# EAGLE schematic Mixer (EAGLE 9.6.2)

## Sheet 1 of 5: Mixer
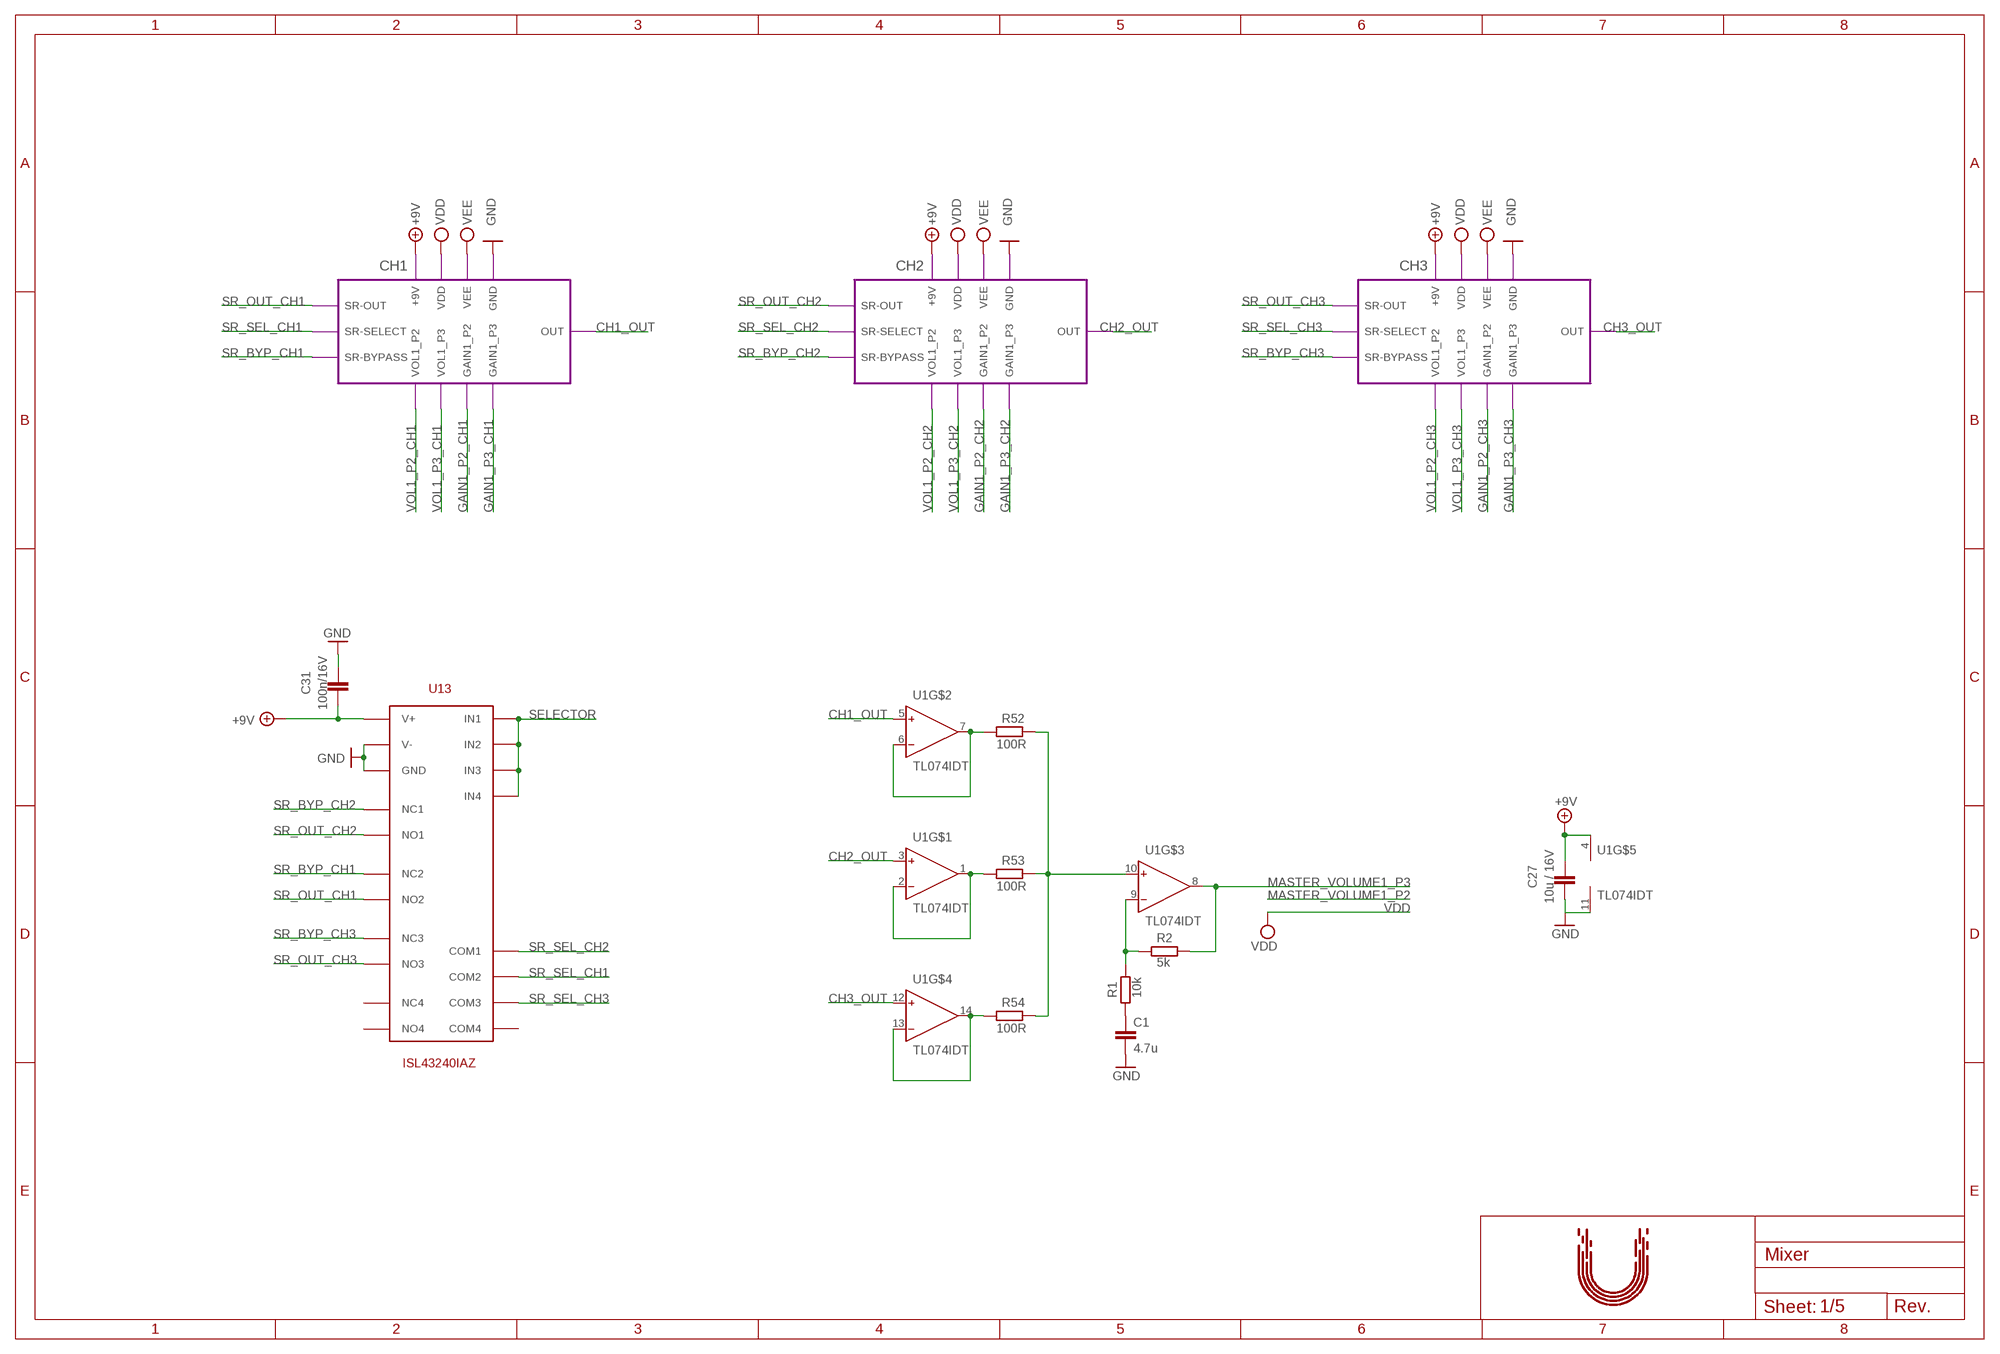
[diagram p0: schematic, sheet 1]

### Parts
C1  4.7u  CAPACITORC-0603  [0603]
C27  10u / 16V  CAPACITORC-0603  [0603]
C31  100n/16V  CAPACITORC-0603  [0603]
R1  10k  RESISTOR  [R0603]
R2  5k  RESISTOR  [R0603]
R52  100R  RESISTOR  [R0603]
R53  100R  RESISTOR  [R0603]
R54  100R  RESISTOR  [R0603]
U1  TL074IDT  [SOIC127P600X175-14N]
U13  ISL43240IAZ  ANALOG_SELECTORSSOP-20  [SOP65P777X173-20N]
U$1  UTBULT_DESIGN4  [UD_4]

### Module instances
CH1 = CHANNEL_INPUT
CH2 = CHANNEL_INPUT
CH3 = CHANNEL_INPUT

### Nets
+9V: C27.2 C31.1 U1.4(V+) U13.16(V+) ; port CH1.+9V CH2.+9V CH3.+9V ; also sheet 2,3,4,5
CH1_OUT: U1.5(IN+) ; port CH1.OUT ; also sheet 4
CH2_OUT: U1.3(IN+) ; port CH2.OUT ; also sheet 4
CH3_OUT: U1.12(IN+) ; port CH3.OUT ; also sheet 4
GAIN1_P2_CH1: port CH1.GAIN1_P2 ; also sheet 5
GAIN1_P2_CH2: port CH2.GAIN1_P2 ; also sheet 5
GAIN1_P2_CH3: port CH3.GAIN1_P2 ; also sheet 5
GAIN1_P3_CH1: port CH1.GAIN1_P3 ; also sheet 5
GAIN1_P3_CH2: port CH2.GAIN1_P3 ; also sheet 5
GAIN1_P3_CH3: port CH3.GAIN1_P3 ; also sheet 5
GND: C1.2 C27.1 C31.2 U1.11(V-) U13.5(V-) U13.6(GND) ; port CH1.GND CH2.GND CH3.GND ; also sheet 2,3,4,5
MASTER_VOLUME1_P3: R2.2 U1.8(OUT) ; also sheet 5
N$1: R52.2 R53.2 R54.2 U1.10(IN+)
N$2: R1.2 R2.1 U1.9(IN-)
N$4: C1.1 R1.1
N$33: R52.1 U1.6(IN-) U1.7(OUT)
N$36: R53.1 U1.1(OUT) U1.2(IN-)
N$39: R54.1 U1.13(IN-) U1.14(OUT)
SELECTOR: U13.1(IN1) U13.10(IN2) U13.11(IN3) U13.20(IN4) ; also sheet 2,5
SR_BYP_CH1: U13.7(NC2) ; port CH1.SR-BYPASS
SR_BYP_CH2: U13.4(NC1) ; port CH2.SR-BYPASS
SR_BYP_CH3: U13.14(NC3) ; port CH3.SR-BYPASS
SR_OUT_CH1: U13.9(NO2) ; port CH1.SR-OUT
SR_OUT_CH2: U13.2(NO1) ; port CH2.SR-OUT
SR_OUT_CH3: U13.12(NO3) ; port CH3.SR-OUT
SR_SEL_CH1: U13.8(COM2) ; port CH1.SR-SELECT
SR_SEL_CH2: U13.3(COM1) ; port CH2.SR-SELECT
SR_SEL_CH3: U13.13(COM3) ; port CH3.SR-SELECT
VDD: port CH1.VDD CH2.VDD CH3.VDD ; also sheet 2,3,4,5
VEE: port CH1.VEE CH2.VEE CH3.VEE ; also sheet 2,3,4
VOL1_P2_CH1: port CH1.VOL1_P2 ; also sheet 5
VOL1_P2_CH2: port CH2.VOL1_P2 ; also sheet 5
VOL1_P2_CH3: port CH3.VOL1_P2 ; also sheet 5
VOL1_P3_CH1: port CH1.VOL1_P3 ; also sheet 5
VOL1_P3_CH2: port CH2.VOL1_P3 ; also sheet 5
VOL1_P3_CH3: port CH3.VOL1_P3 ; also sheet 5
Unconnected: U13.17(NC4) U13.18(COM4) U13.19(NO4)

## Sheet 2 of 5: Mixed send/return
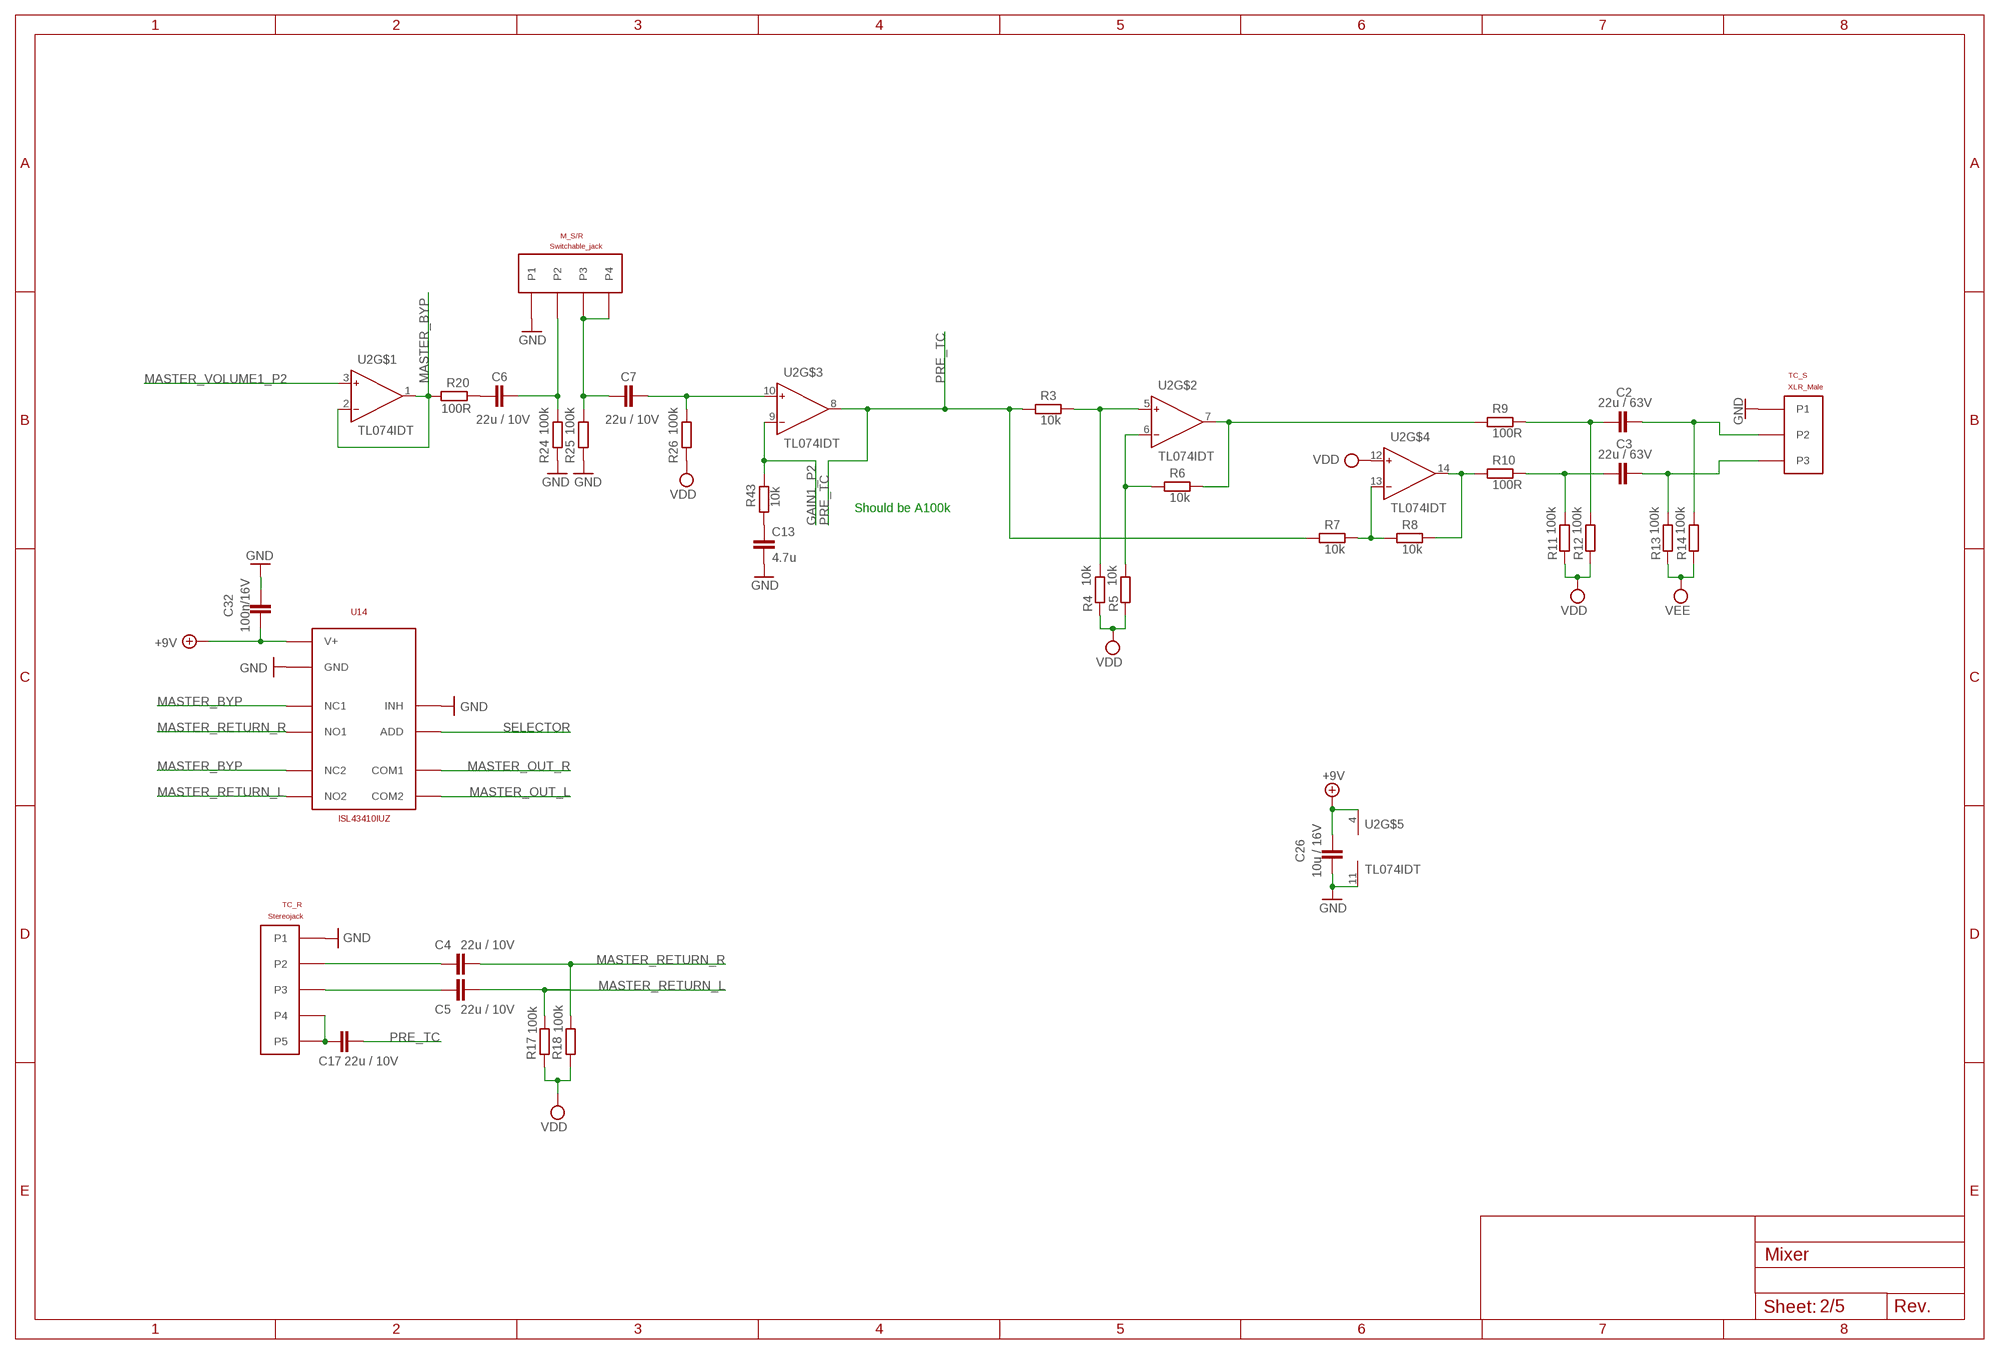
[diagram p1: schematic, sheet 2]

### Parts
C2  22u / 63V  CAPACITOR2220  [2220]
C3  22u / 63V  CAPACITOR2220  [2220]
C4  22u / 10V  CAPACITORC-0603  [0603]
C5  22u / 10V  CAPACITORC-0603  [0603]
C6  22u / 10V  CAPACITORC-0603  [0603]
C7  22u / 10V  CAPACITORC-0603  [0603]
C13  4.7u  CAPACITORC-0603  [0603]
C17  22u / 10V  CAPACITORC-0603  [0603]
C26  10u / 16V  CAPACITORC-0603  [0603]
C32  100n/16V  CAPACITORC-0603  [0603]
M_S/R  Switchable_jack  4_PIN_PORT  [4_PIN_PORT]
R3  10k  RESISTOR  [R0603]
R4  10k  RESISTOR  [R0603]
R5  10k  RESISTOR  [R0603]
R6  10k  RESISTOR  [R0603]
R7  10k  RESISTOR  [R0603]
R8  10k  RESISTOR  [R0603]
R9  100R  RESISTOR  [R0603]
R10  100R  RESISTOR  [R0603]
R11  100k  RESISTOR  [R0603]
R12  100k  RESISTOR  [R0603]
R13  100k  RESISTOR  [R0603]
R14  100k  RESISTOR  [R0603]
R17  100k  RESISTOR  [R0603]
R18  100k  RESISTOR  [R0603]
R20  100R  RESISTOR  [R0603]
R24  100k  RESISTOR  [R0603]
R25  100k  RESISTOR  [R0603]
R26  100k  RESISTOR  [R0603]
R43  10k  RESISTOR  [R0603]
TC_R  Stereojack  5_PIN_PORT  [5_PIN_PORT]
TC_S  XLR_Male  3_PIN_PORT  [3_PIN_PORT]
U2  TL074IDT  [SOIC127P600X175-14N]
U14  ISL43410IUZ  2CH_ANALOG_SELECTORMSOP-10  [SOP50P490X110-10N]

### Nets
+9V: C26.2 C32.1 U2.4(V+) U14.10(V+) ; also sheet 1,3,4,5
GAIN1_P2: R43.2 U2.9(IN-) ; also sheet 5
GND: C13.2 C26.1 C32.2 M_S/R.P$1(P1) R24.1 R25.1 TC_R.P$1(P1) TC_S.P$1(P1) U2.11(V-) U14.4(INH) U14.5(GND) ; also sheet 1,3,4,5
MASTER_BYP: R20.1 U2.1(OUT) U2.2(IN-) U14.3(NC1) U14.7(NC2)
MASTER_OUT_L: U14.8(COM2) ; also sheet 3,4
MASTER_OUT_R: U14.2(COM1) ; also sheet 3,4
MASTER_RETURN_L: C5.2 R17.2 U14.9(NO2)
MASTER_RETURN_R: C4.2 R18.2 U14.1(NO1)
MASTER_VOLUME1_P2: U2.3(IN+) ; also sheet 1,5
N$5: R3.2 R4.2 U2.5(IN+)
N$6: R5.2 R6.1 U2.6(IN-)
N$7: R6.2 R9.1 U2.7(OUT)
N$8: R7.2 R8.1 U2.13(IN-)
N$9: R8.2 R10.1 U2.14(OUT)
N$10: C3.1 R10.2 R11.2
N$11: C2.1 R9.2 R12.2
N$13: C4.1 TC_R.P$2(P2)
N$14: C5.1 TC_R.P$3(P3)
N$20: C7.1 M_S/R.P$3(P3) M_S/R.P$4(P4) R25.2
N$21: C6.1 R20.2
N$49: C7.2 R26.2 U2.10(IN+)
N$50: C13.1 R43.1
N$55: C17.1 TC_R.P$4(P4) TC_R.P$5(P5)
PRE_TC: C17.2 R3.1 R7.1 U2.8(OUT) ; also sheet 5
SELECTOR: U14.6(ADD) ; also sheet 1,5
TC_OUT+: C2.2 R14.2 TC_S.P$2(P2)
TC_OUT-: C3.2 R13.2 TC_S.P$3(P3)
VDD: R4.1 R5.1 R11.1 R12.1 R17.1 R18.1 R26.1 U2.12(IN+) ; also sheet 1,3,4,5
VEE: R13.1 R14.1 ; also sheet 1,3,4
VOL1_P3: C6.2 M_S/R.P$2(P2) R24.2

### Notes on the sheet
- Should be A100k

## Sheet 3 of 5: Master Out
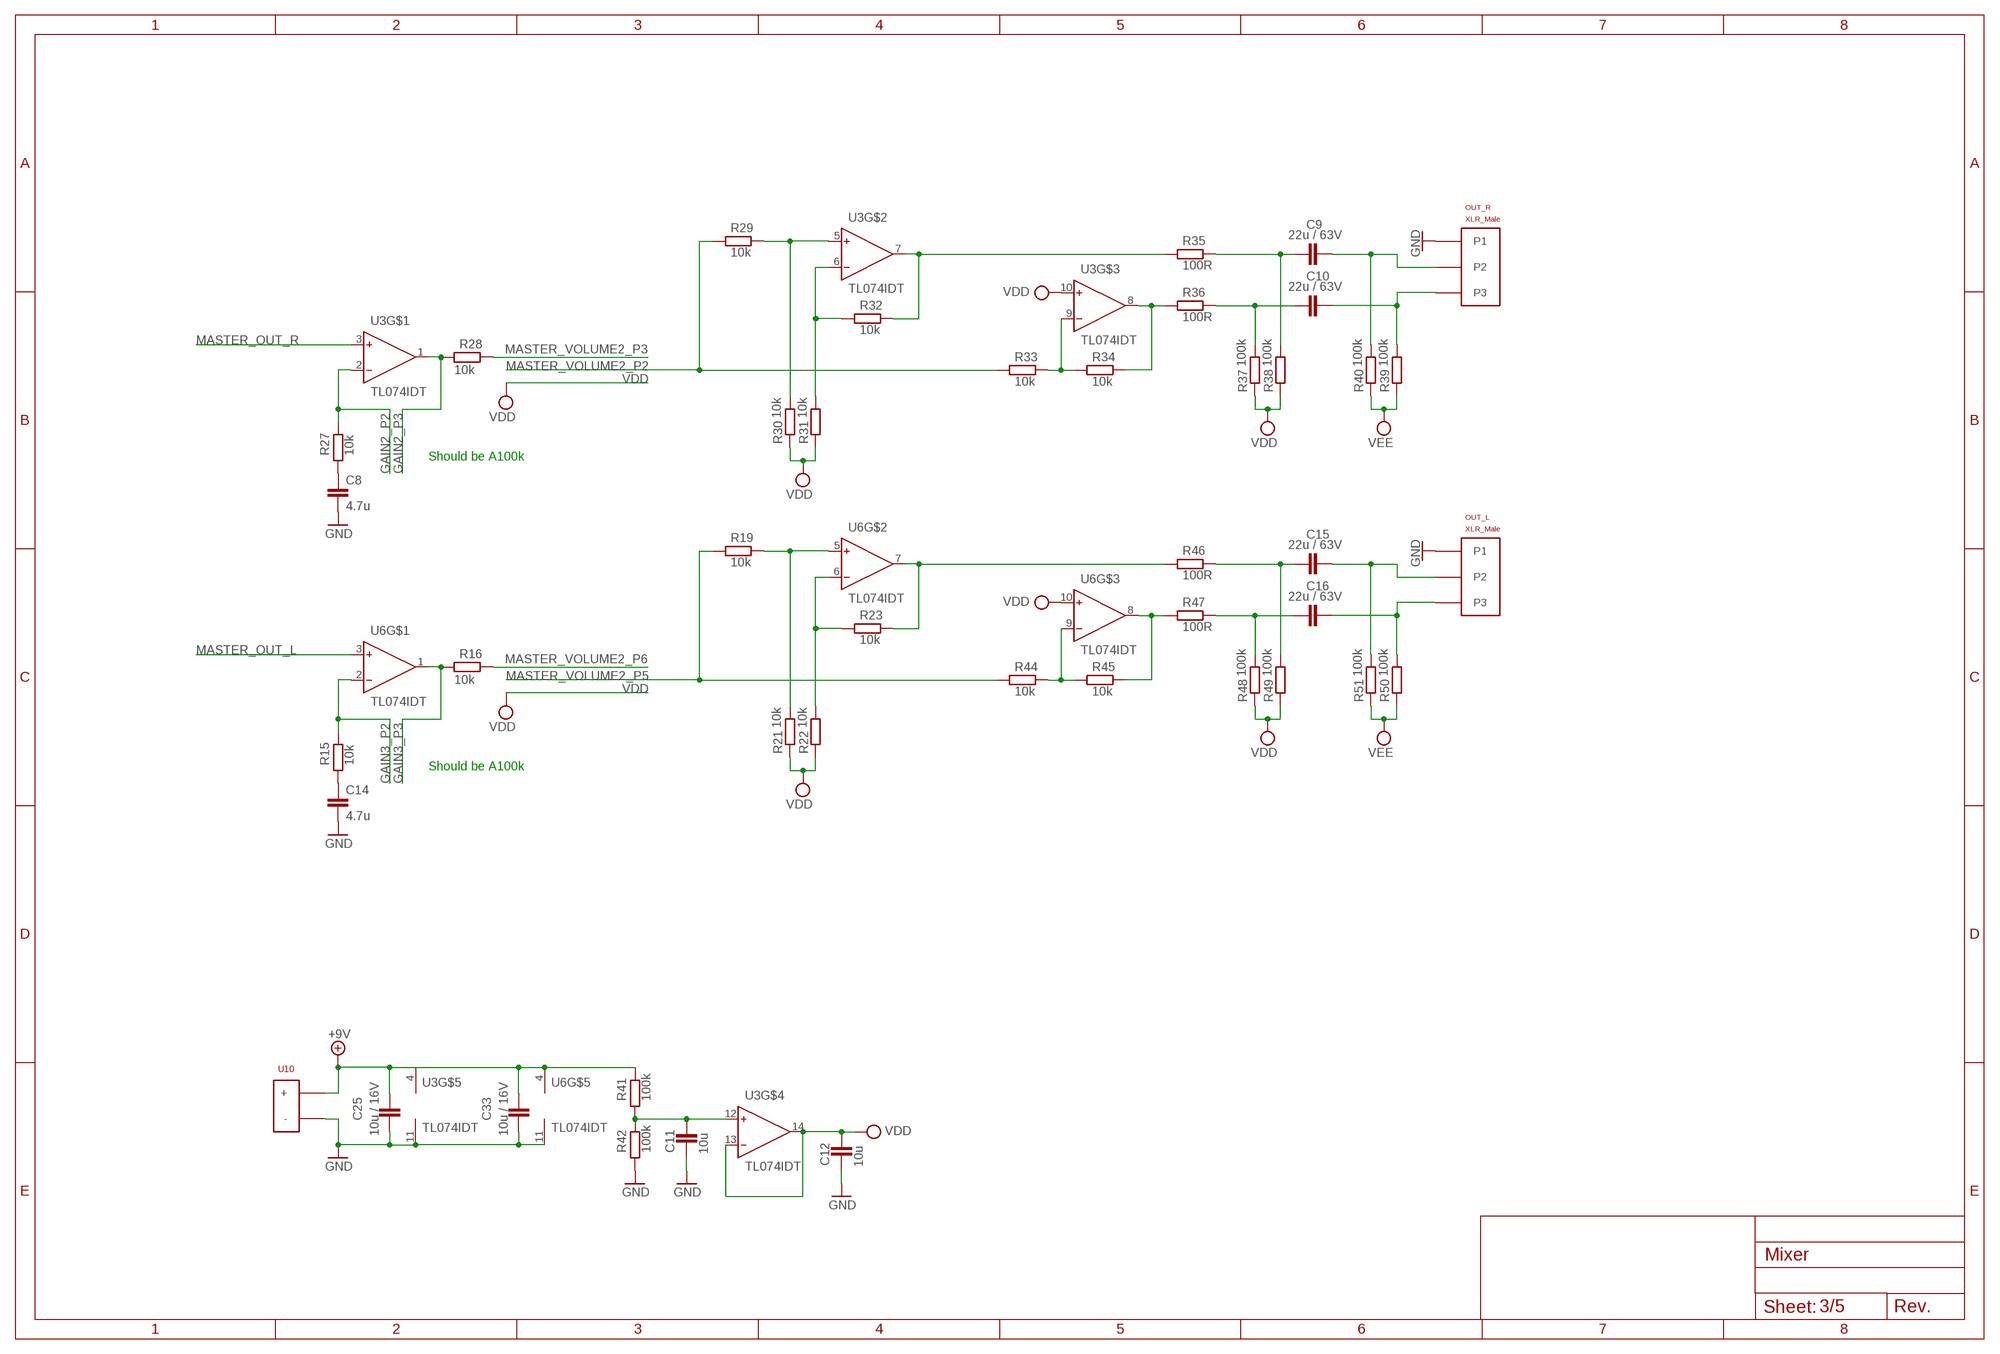
[diagram p2: schematic, sheet 3]

### Parts
C8  4.7u  CAPACITORC-0603  [0603]
C9  22u / 63V  CAPACITOR2220  [2220]
C10  22u / 63V  CAPACITOR2220  [2220]
C11  10u  CAPACITORC-0603  [0603]
C12  10u  CAPACITORC-0603  [0603]
C14  4.7u  CAPACITORC-0603  [0603]
C15  22u / 63V  CAPACITOR2220  [2220]
C16  22u / 63V  CAPACITOR2220  [2220]
C25  10u / 16V  CAPACITORC-0603  [0603]
C33  10u / 16V  CAPACITORC-0603  [0603]
OUT_L  XLR_Male  3_PIN_PORT  [3_PIN_PORT]
OUT_R  XLR_Male  3_PIN_PORT  [3_PIN_PORT]
R15  10k  RESISTOR  [R0603]
R16  10k  RESISTOR  [R0603]
R19  10k  RESISTOR  [R0603]
R21  10k  RESISTOR  [R0603]
R22  10k  RESISTOR  [R0603]
R23  10k  RESISTOR  [R0603]
R27  10k  RESISTOR  [R0603]
R28  10k  RESISTOR  [R0603]
R29  10k  RESISTOR  [R0603]
R30  10k  RESISTOR  [R0603]
R31  10k  RESISTOR  [R0603]
R32  10k  RESISTOR  [R0603]
R33  10k  RESISTOR  [R0603]
R34  10k  RESISTOR  [R0603]
R35  100R  RESISTOR  [R0603]
R36  100R  RESISTOR  [R0603]
R37  100k  RESISTOR  [R0603]
R38  100k  RESISTOR  [R0603]
R39  100k  RESISTOR  [R0603]
R40  100k  RESISTOR  [R0603]
R41  100k  RESISTOR  [R0603]
R42  100k  RESISTOR  [R0603]
R44  10k  RESISTOR  [R0603]
R45  10k  RESISTOR  [R0603]
R46  100R  RESISTOR  [R0603]
R47  100R  RESISTOR  [R0603]
R48  100k  RESISTOR  [R0603]
R49  100k  RESISTOR  [R0603]
R50  100k  RESISTOR  [R0603]
R51  100k  RESISTOR  [R0603]
U3  TL074IDT  [SOIC127P600X175-14N]
U6  TL074IDT  [SOIC127P600X175-14N]
U10  POWER  [POWER]

### Nets
+9V: C25.2 C33.2 R41.2 U3.4(V+) U6.4(V+) U10.P$1(+) ; also sheet 1,2,4,5
GAIN2_P2: R27.2 U3.2(IN-) ; also sheet 5
GAIN2_P3: R28.1 U3.1(OUT) ; also sheet 5
GAIN3_P2: R15.2 U6.2(IN-) ; also sheet 5
GAIN3_P3: R16.1 U6.1(OUT) ; also sheet 5
GND: C8.2 C11.2 C12.2 C14.2 C25.1 C33.1 OUT_L.P$1(P1) OUT_R.P$1(P1) R42.1 U3.11(V-) U6.11(V-) U10.P$2(-) ; also sheet 1,2,4,5
MASTER_OUT_L: U6.3(IN+) ; also sheet 2,4
MASTER_OUT_R: U3.3(IN+) ; also sheet 2,4
MASTER_VOLUME2_P2: R29.1 R33.1 ; also sheet 5
MASTER_VOLUME2_P3: R28.2 ; also sheet 5
MASTER_VOLUME2_P5: R19.1 R44.1 ; also sheet 5
MASTER_VOLUME2_P6: R16.2 ; also sheet 5
N$3: C14.1 R15.1
N$12: R19.2 R21.2 U6.5(IN+)
N$16: R22.2 R23.1 U6.6(IN-)
N$17: R23.2 R46.1 U6.7(OUT)
N$18: R44.2 R45.1 U6.9(IN-)
N$19: R45.2 R47.1 U6.8(OUT)
N$22: R29.2 R30.2 U3.5(IN+)
N$23: R31.2 R32.1 U3.6(IN-)
N$24: C8.1 R27.1
N$25: C11.1 R41.1 R42.2 U3.12(IN+)
N$26: R32.2 R35.1 U3.7(OUT)
N$27: R33.2 R34.1 U3.9(IN-)
N$28: R34.2 R36.1 U3.8(OUT)
N$29: C10.1 R36.2 R37.2
N$30: C9.1 R35.2 R38.2
N$31: C10.2 OUT_R.P$3(P3) R39.2
N$32: C9.2 OUT_R.P$2(P2) R40.2
N$51: C16.1 R47.2 R48.2
N$52: C15.1 R46.2 R49.2
N$53: C16.2 OUT_L.P$3(P3) R50.2
N$54: C15.2 OUT_L.P$2(P2) R51.2
VDD: C12.1 R21.1 R22.1 R30.1 R31.1 R37.1 R38.1 R48.1 R49.1 U3.10(IN+) U3.13(IN-) U3.14(OUT) U6.10(IN+) ; also sheet 1,2,4,5
VEE: R39.1 R40.1 R50.1 R51.1 ; also sheet 1,2,4
Unconnected: U6.12(IN+) U6.13(IN-) U6.14(OUT)

### Notes on the sheet
- Should be A100k
- Should be A100k

## Sheet 4 of 5: Monitor
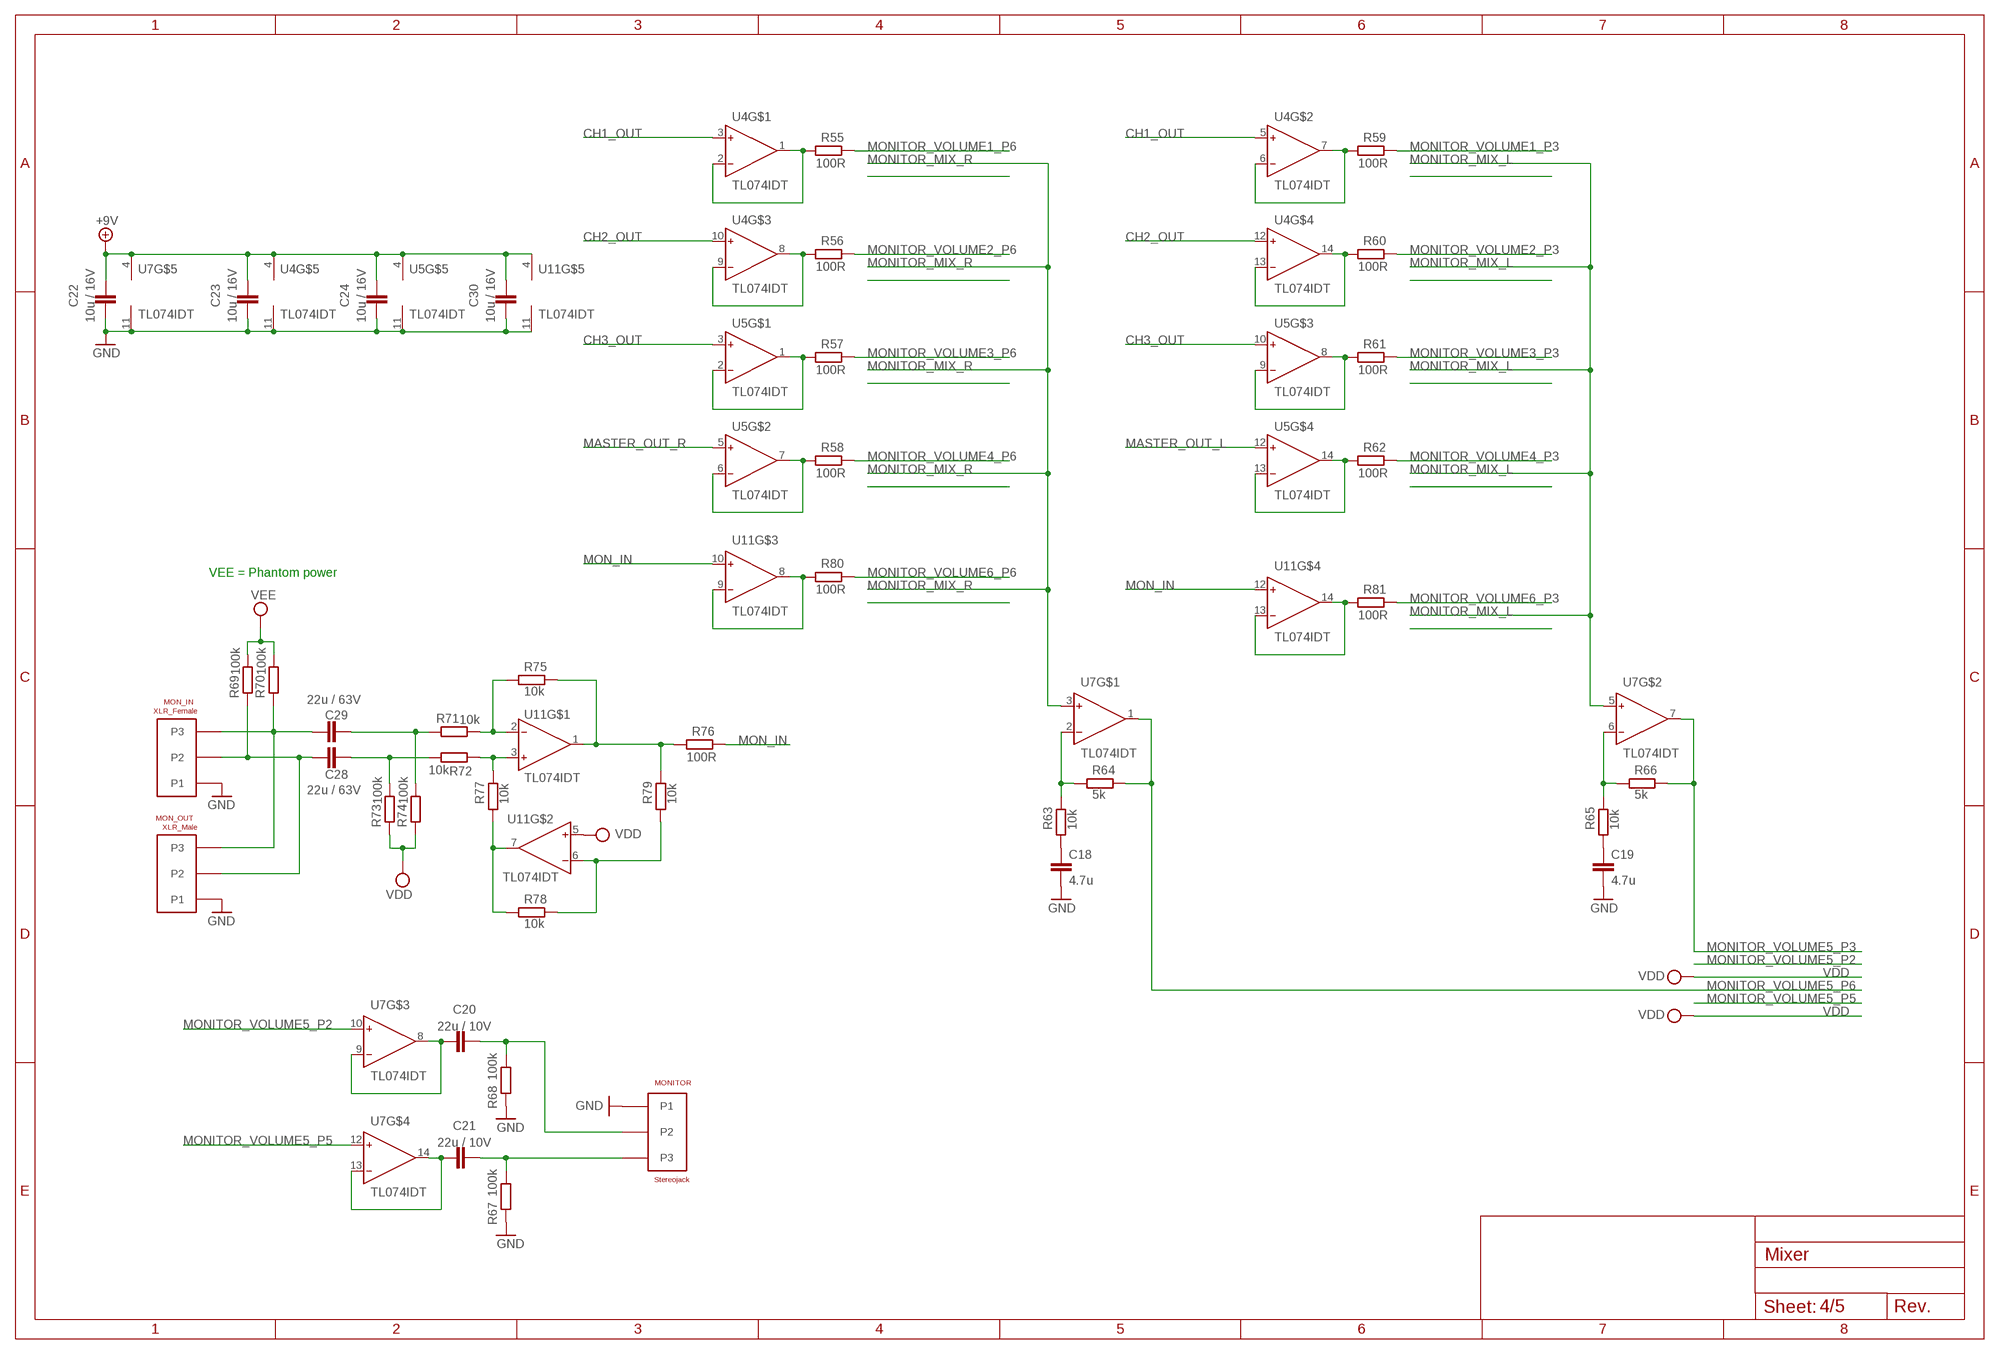
[diagram p3: schematic, sheet 4]

### Parts
C18  4.7u  CAPACITORC-0603  [0603]
C19  4.7u  CAPACITORC-0603  [0603]
C20  22u / 10V  CAPACITORC-0603  [0603]
C21  22u / 10V  CAPACITORC-0603  [0603]
C22  10u / 16V  CAPACITORC-0603  [0603]
C23  10u / 16V  CAPACITORC-0603  [0603]
C24  10u / 16V  CAPACITORC-0603  [0603]
C28  22u / 63V  CAPACITOR2220  [2220]
C29  22u / 63V  CAPACITOR2220  [2220]
C30  10u / 16V  CAPACITORC-0603  [0603]
MON_IN  XLR_Female  3_PIN_PORT  [3_PIN_PORT]
MON_OUT  XLR_Male  3_PIN_PORT  [3_PIN_PORT]
MONITOR  Stereojack  3_PIN_PORT  [3_PIN_PORT]
R55  100R  RESISTOR  [R0603]
R56  100R  RESISTOR  [R0603]
R57  100R  RESISTOR  [R0603]
R58  100R  RESISTOR  [R0603]
R59  100R  RESISTOR  [R0603]
R60  100R  RESISTOR  [R0603]
R61  100R  RESISTOR  [R0603]
R62  100R  RESISTOR  [R0603]
R63  10k  RESISTOR  [R0603]
R64  5k  RESISTOR  [R0603]
R65  10k  RESISTOR  [R0603]
R66  5k  RESISTOR  [R0603]
R67  100k  RESISTOR  [R0603]
R68  100k  RESISTOR  [R0603]
R69  100k  RESISTOR  [R0603]
R70  100k  RESISTOR  [R0603]
R71  10k  RESISTOR  [R0603]
R72  10k  RESISTOR  [R0603]
R73  100k  RESISTOR  [R0603]
R74  100k  RESISTOR  [R0603]
R75  10k  RESISTOR  [R0603]
R76  100R  RESISTOR  [R0603]
R77  10k  RESISTOR  [R0603]
R78  10k  RESISTOR  [R0603]
R79  10k  RESISTOR  [R0603]
R80  100R  RESISTOR  [R0603]
R81  100R  RESISTOR  [R0603]
U4  TL074IDT  [SOIC127P600X175-14N]
U5  TL074IDT  [SOIC127P600X175-14N]
U7  TL074IDT  [SOIC127P600X175-14N]
U11  TL074IDT  [SOIC127P600X175-14N]

### Nets
+9V: C22.2 C23.2 C24.2 C30.2 U4.4(V+) U5.4(V+) U7.4(V+) U11.4(V+) ; also sheet 1,2,3,5
CH1_OUT: U4.3(IN+) U4.5(IN+) ; also sheet 1
CH2_OUT: U4.10(IN+) U4.12(IN+) ; also sheet 1
CH3_OUT: U5.3(IN+) U5.10(IN+) ; also sheet 1
GND: C18.2 C19.2 C22.1 C23.1 C24.1 C30.1 MON_IN.P$1(P1) MON_OUT.P$1(P1) MONITOR.P$1(P1) R67.1 R68.1 U4.11(V-) U5.11(V-) U7.11(V-) U11.11(V-) ; also sheet 1,2,3,5
MASTER_OUT_L: U5.12(IN+) ; also sheet 2,3
MASTER_OUT_R: U5.5(IN+) ; also sheet 2,3
MON_IN: R76.2 U11.10(IN+) U11.12(IN+)
MONITOR_MIX_L: U7.5(IN+) ; also sheet 5
MONITOR_MIX_R: U7.3(IN+) ; also sheet 5
MONITOR_VOLUME1_P3: R59.2 ; also sheet 5
MONITOR_VOLUME1_P6: R55.2 ; also sheet 5
MONITOR_VOLUME2_P3: R60.2 ; also sheet 5
MONITOR_VOLUME2_P6: R56.2 ; also sheet 5
MONITOR_VOLUME3_P3: R61.2 ; also sheet 5
MONITOR_VOLUME3_P6: R57.2 ; also sheet 5
MONITOR_VOLUME4_P3: R62.2 ; also sheet 5
MONITOR_VOLUME4_P6: R58.2 ; also sheet 5
MONITOR_VOLUME5_P2: U7.10(IN+) ; also sheet 5
MONITOR_VOLUME5_P3: R66.2 U7.7(OUT) ; also sheet 5
MONITOR_VOLUME5_P5: U7.12(IN+) ; also sheet 5
MONITOR_VOLUME5_P6: R64.2 U7.1(OUT) ; also sheet 5
MONITOR_VOLUME6_P3: R81.2 ; also sheet 5
MONITOR_VOLUME6_P6: R80.2 ; also sheet 5
N$34: R55.1 U4.1(OUT) U4.2(IN-)
N$35: R56.1 U4.8(OUT) U4.9(IN-)
N$37: R59.1 U4.6(IN-) U4.7(OUT)
N$38: R60.1 U4.13(IN-) U4.14(OUT)
N$42: R57.1 U5.1(OUT) U5.2(IN-)
N$43: R61.1 U5.8(OUT) U5.9(IN-)
N$44: R63.2 R64.1 U7.2(IN-)
N$45: R58.1 U5.6(IN-) U5.7(OUT)
N$46: R62.1 U5.13(IN-) U5.14(OUT)
N$47: C18.1 R63.1
N$48: R65.2 R66.1 U7.6(IN-)
N$56: C19.1 R65.1
N$57: C20.1 U7.8(OUT) U7.9(IN-)
N$60: C21.1 U7.13(IN-) U7.14(OUT)
N$61: C20.2 MONITOR.P$2(P2) R68.2
N$62: C21.2 MONITOR.P$3(P3) R67.2
N$63: C29.1 MON_IN.P$3(P3) MON_OUT.P$3(P3) R70.1
N$64: C28.1 MON_IN.P$2(P2) MON_OUT.P$2(P2) R69.1
N$66: C29.2 R71.1 R74.2
N$68: C28.2 R72.2 R73.2
N$70: R72.1 R77.2 U11.3(IN+)
N$72: R71.2 R75.1 U11.2(IN-)
N$73: R78.2 R79.1 U11.6(IN-)
N$74: R77.1 R78.1 U11.7(OUT)
N$75: R75.2 R76.1 R79.2 U11.1(OUT)
N$77: R80.1 U11.8(OUT) U11.9(IN-)
N$80: R81.1 U11.13(IN-) U11.14(OUT)
VDD: R73.1 R74.1 U11.5(IN+) ; also sheet 1,2,3,5
VEE: R69.2 R70.2 ; also sheet 1,2,3

### Notes on the sheet
- VEE = Phantom power

## Sheet 5 of 5: Headers
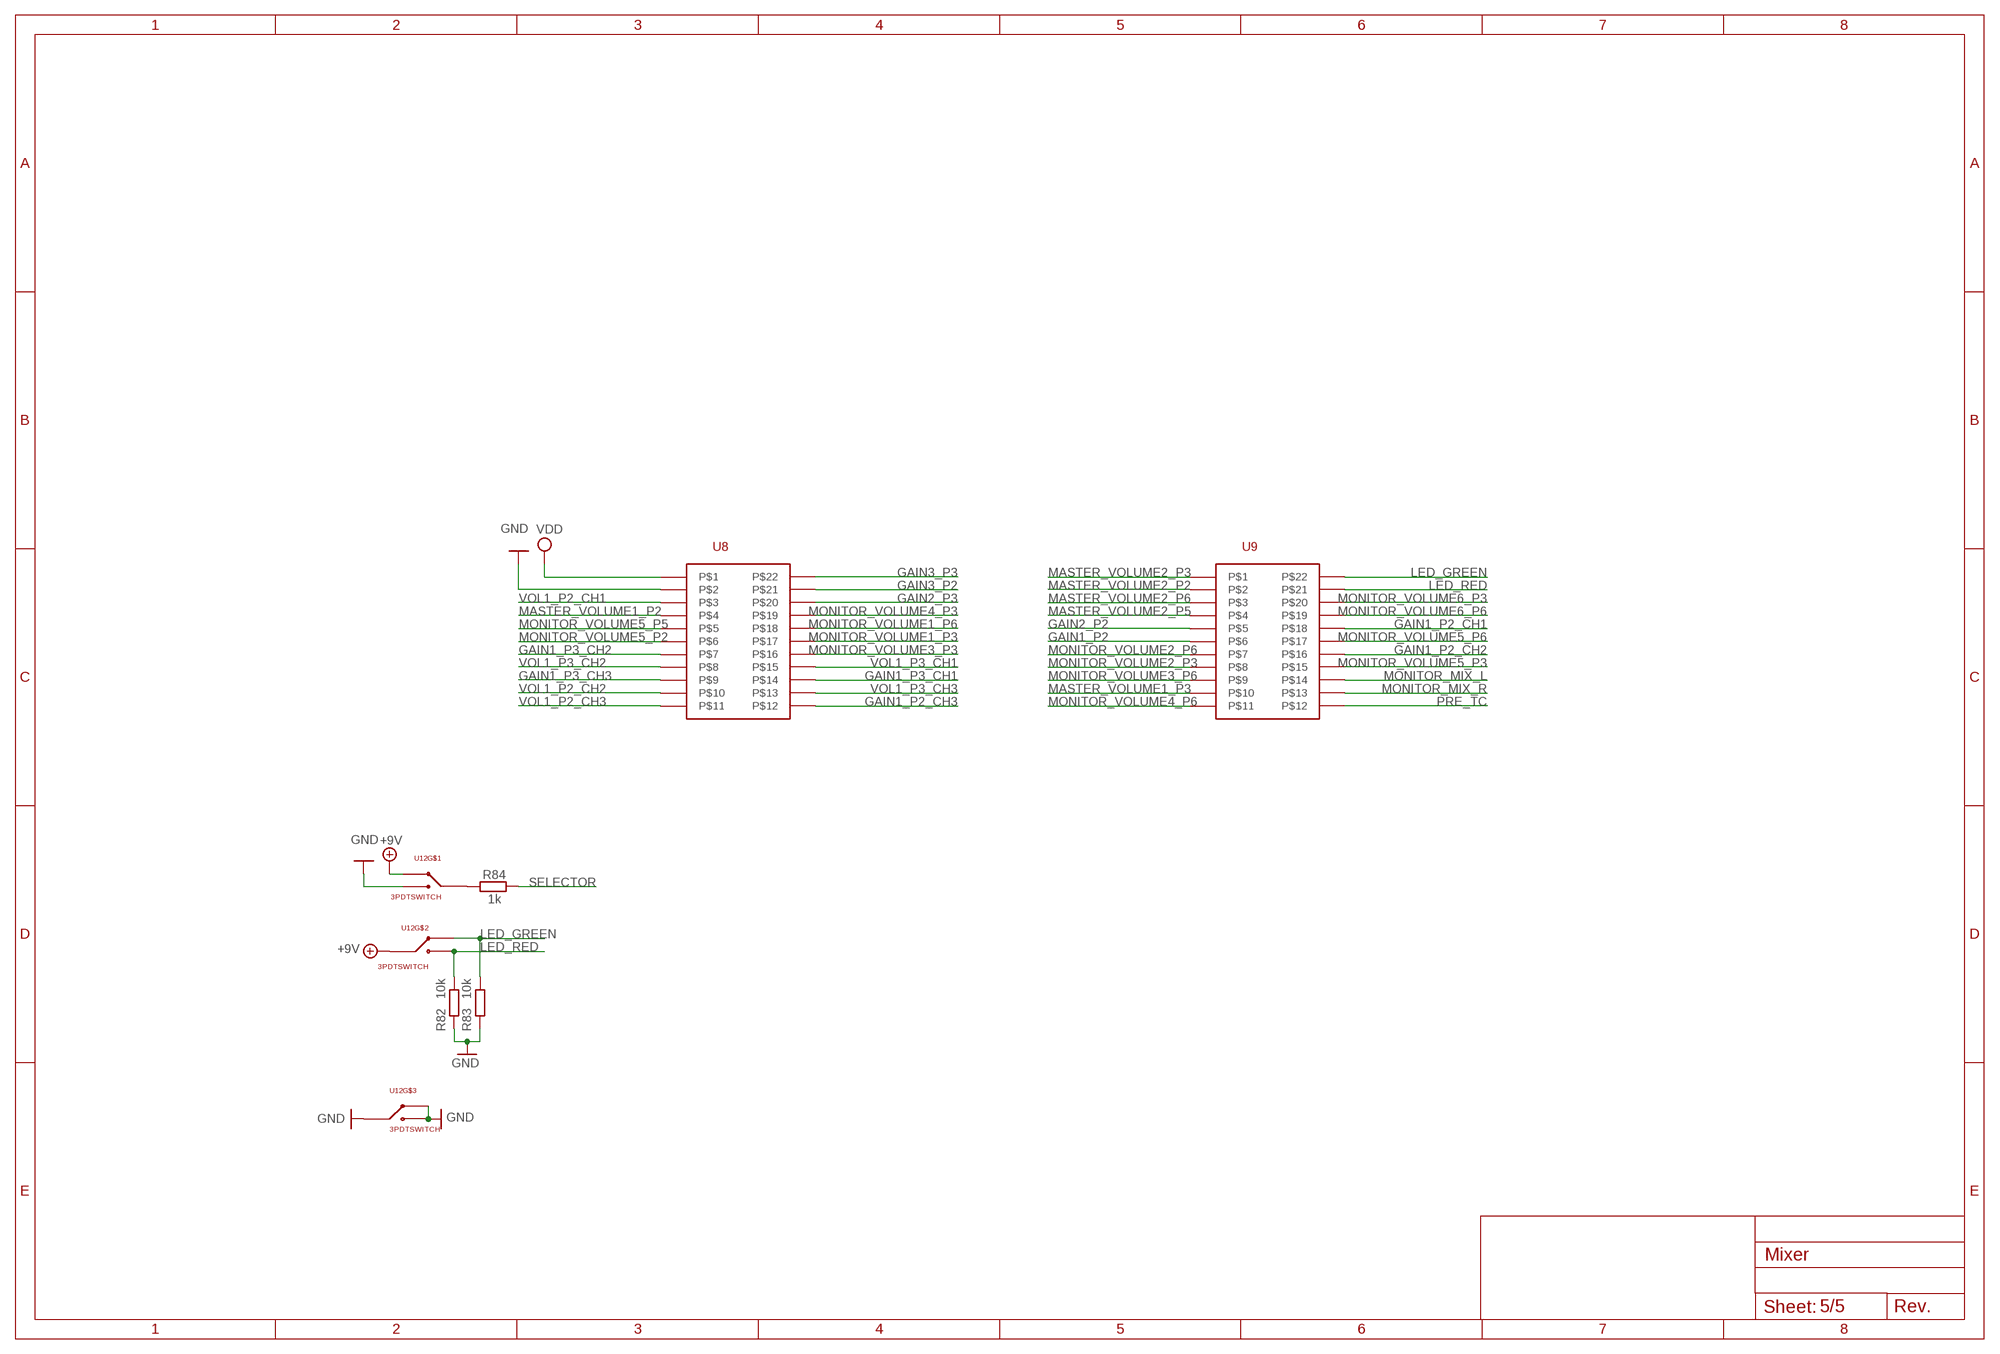
[diagram p4: schematic, sheet 5]

### Parts
R82  10k  RESISTOR  [R0603]
R83  10k  RESISTOR  [R0603]
R84  1k  RESISTOR  [R0603]
U8  22PINHEADER22PINHEADER  [HDRV22W64P254_2X11_2794X508X838B]
U9  22PINHEADER22PINHEADER  [HDRV22W64P254_2X11_2794X508X838B]
U12  3PDTSWITCH  [FS57003PLT2B2M1QE]

### Nets
+9V: U12.P$1 U12.P$5 ; also sheet 1,2,3,4
GAIN1_P2: U9.6 ; also sheet 2
GAIN1_P2_CH1: U9.18 ; also sheet 1
GAIN1_P2_CH2: U9.16 ; also sheet 1
GAIN1_P2_CH3: U8.12 ; also sheet 1
GAIN1_P3_CH1: U8.14 ; also sheet 1
GAIN1_P3_CH2: U8.7 ; also sheet 1
GAIN1_P3_CH3: U8.9 ; also sheet 1
GAIN2_P2: U9.5 ; also sheet 3
GAIN2_P3: U8.20 ; also sheet 3
GAIN3_P2: U8.21 ; also sheet 3
GAIN3_P3: U8.22 ; also sheet 3
GND: R82.1 R83.1 U8.2 U12.P$3 U12.P$7 U12.P$8 U12.P$9 ; also sheet 1,2,3,4
LED_GREEN: R83.2 U9.22 U12.P$4
LED_RED: R82.2 U9.21 U12.P$6
MASTER_VOLUME1_P2: U8.4 ; also sheet 1,2
MASTER_VOLUME1_P3: U9.10 ; also sheet 1
MASTER_VOLUME2_P2: U9.2 ; also sheet 3
MASTER_VOLUME2_P3: U9.1 ; also sheet 3
MASTER_VOLUME2_P5: U9.4 ; also sheet 3
MASTER_VOLUME2_P6: U9.3 ; also sheet 3
MONITOR_MIX_L: U9.14 ; also sheet 4
MONITOR_MIX_R: U9.13 ; also sheet 4
MONITOR_VOLUME1_P3: U8.17 ; also sheet 4
MONITOR_VOLUME1_P6: U8.18 ; also sheet 4
MONITOR_VOLUME2_P3: U9.8 ; also sheet 4
MONITOR_VOLUME2_P6: U9.7 ; also sheet 4
MONITOR_VOLUME3_P3: U8.16 ; also sheet 4
MONITOR_VOLUME3_P6: U9.9 ; also sheet 4
MONITOR_VOLUME4_P3: U8.19 ; also sheet 4
MONITOR_VOLUME4_P6: U9.11 ; also sheet 4
MONITOR_VOLUME5_P2: U8.6 ; also sheet 4
MONITOR_VOLUME5_P3: U9.15 ; also sheet 4
MONITOR_VOLUME5_P5: U8.5 ; also sheet 4
MONITOR_VOLUME5_P6: U9.17 ; also sheet 4
MONITOR_VOLUME6_P3: U9.20 ; also sheet 4
MONITOR_VOLUME6_P6: U9.19 ; also sheet 4
N$15: R84.1 U12.P$2
PRE_TC: U9.12 ; also sheet 2
SELECTOR: R84.2 ; also sheet 1,2
VDD: U8.1 ; also sheet 1,2,3,4
VOL1_P2_CH1: U8.3 ; also sheet 1
VOL1_P2_CH2: U8.10 ; also sheet 1
VOL1_P2_CH3: U8.11 ; also sheet 1
VOL1_P3_CH1: U8.15 ; also sheet 1
VOL1_P3_CH2: U8.8 ; also sheet 1
VOL1_P3_CH3: U8.13 ; also sheet 1

## Library data of the parts
C1 C8 C11-C14 C18 C19 = lib:CAPACITOR: Capacitor
C2 C3 C9 C10 C15 C16 C28 C29 = lib:CAPACITOR: Capacitor; LINK: https://www.mouser.se/ProductDetail/TDK/C5750X7S2A226M280KB?qs=sGAEpiMZZMsh%252B1woXyUXj%252BH%2Fz7ysGLLiRJybAXc31rk%3D; MOUSERNO: 810-C5750X7S2A226280; MPN: C5750X7S2A226M280KB; SUPPLIER: Mouser
C4-C7 C17 C20-C27 C30-C33 = lib:CAPACITOR: Capacitor; LINK: https://www.mouser.se/ProductDetail/Murata-Electronics/GRM187R61A226ME15D?qs=sGAEpiMZZMsh%252B1woXyUXjxHEpf2Q6q57J1Ind0WCnj4%3D; MOUSERNR: 81-GRM187R61A226ME5D; MPN: GRM187R61A226ME15D; SUPPLIER: Mouser
M_S/R = lib:4_PIN_PORT
MON_IN MON_OUT MONITOR OUT_L OUT_R TC_S = lib:3_PIN_PORT
R1-R84 = lib:RESISTOR
TC_R = lib:5_PIN_PORT
U1-U7 U11 = lib:TL074IDT: Low noise JFET quad operational amplifier; LINK: https://www.mouser.se/ProductDetail/STMicroelectronics/TL074IDT?qs=xiMLMHqF5JUaM%252BCWVyDQFA%3D%3D; MOUSERNR: 511-TL074IDT; MPN: TL074IDT; SUPPLIER: Mouser
U8 U9 = lib:22PINHEADER; LINK: https://www.mouser.se/ProductDetail/Harwin/M20-9721146?qs=93uzuGORGqcafMOv5UPAWg%3D%3D; MOUSERNR: 855-M20-9721146; MPN: M20-9721146; SUPPLIER: Mouser
U10 = lib:POWER
U12 = lib:3PDTSWITCH: 3PDT Switch Pushbutton Switches High Actuation Foot Switch 10mm dia Actuator, 11.5mm Bushing, 1A 9VDC, 3 Pole, 3000gf, Alternate Action / Maintained, Solder Lug; LINK: https://www.mouser.se/ProductDetail/E-Switch/FS57003PLT2B2M1QE?qs=1mbolxNpo8d2%2F%2FtsGmxrBA%3D%3D; MOUSERNR: 612-FS573PLT2B2M1QE; MPN: FS57003PLT2B2M1QE; SUPPLIER: Mouser
U13 = lib:ANALOG_SELECTOR: Analog selector Analog Switch ICs SWITCH 4X SPDT +/-5V 18OHM IND; LINK: https://www.mouser.se/ProductDetail/Renesas-Intersil/ISL43240IAZ?qs=9fLuogzTs8JpyGgSuWMglw%3D%3D; MOUSERNR: 968-ISL43240IAZ; MPN: ISL43240IAZ; SUPPLIER: Mouser
U14 = lib:2CH_ANALOG_SELECTOR: Analog Selector Analog Switch ICs SWITCH DPDT ENH 3V 65OHM 10MSOP IND; LINK: https://www.mouser.se/ProductDetail/Renesas-Intersil/ISL43410IUZ?qs=9fLuogzTs8IhenJCAVgckg%3D%3D; MOUSERNR: 968-ISL43410IUZ; MPN: ISL43410IUZ; SUPPLIER: Mouser
U$1 = lib:UTBULT_DESIGN

## Module CHANNEL_INPUT
Ports: VDD(io) +9V(io) VEE(io) GND(io) OUT(io) VOL1_P2(io) VOL1_P3(io) GAIN1_P2(io) GAIN1_P3(io) SR-SELECT(io) SR-OUT(io) SR-BYPASS(io)
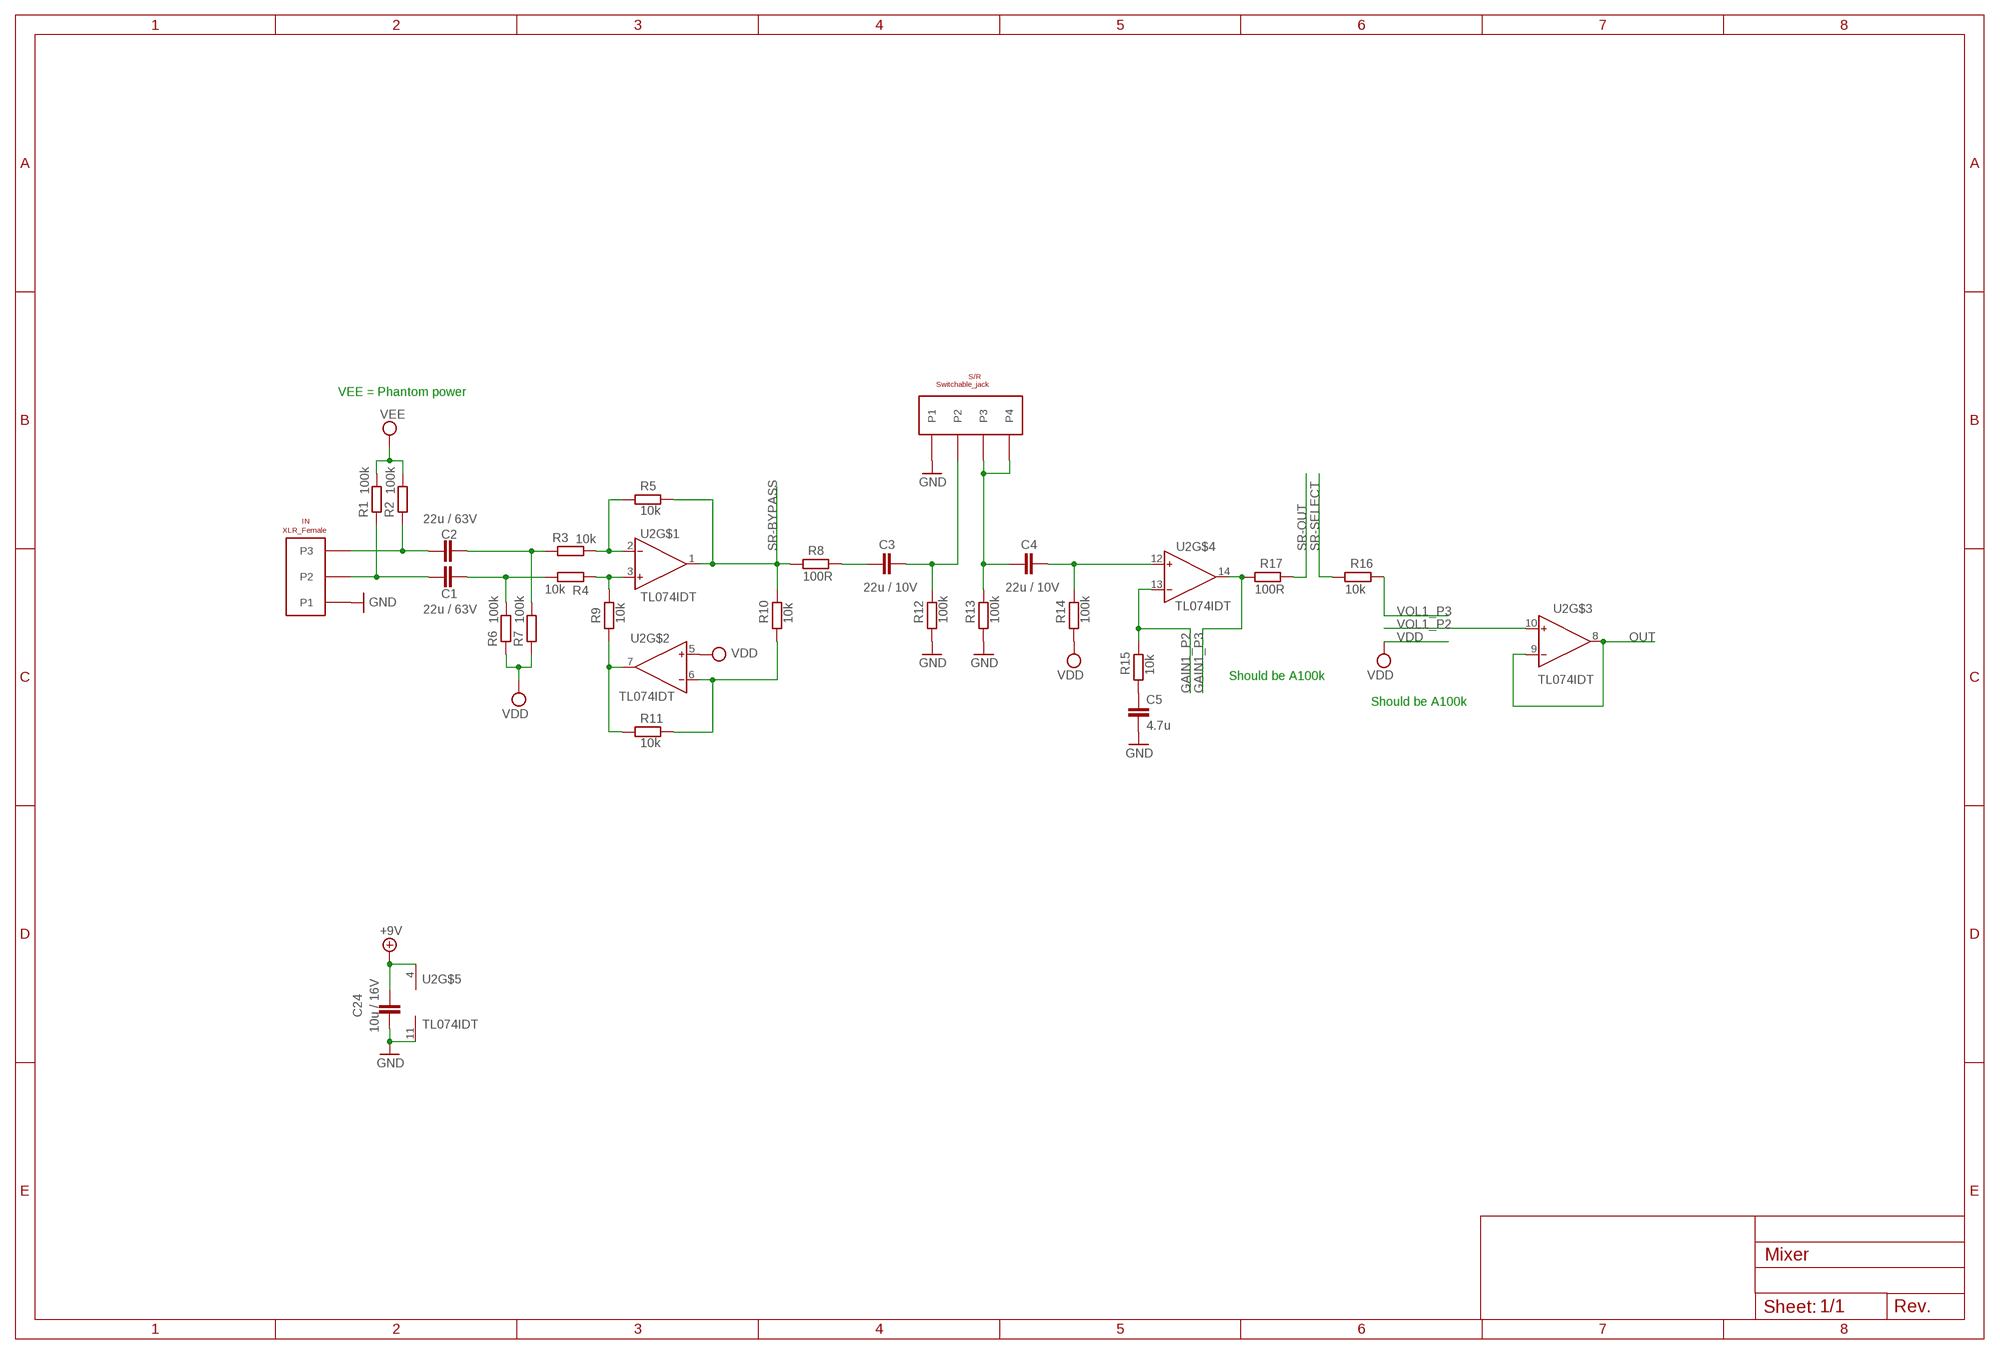
[diagram p5: schematic, module CHANNEL_INPUT, sheet 1]

### Parts
C1  22u / 63V  CAPACITOR2220  [2220]
C2  22u / 63V  CAPACITOR2220  [2220]
C3  22u / 10V  CAPACITORC-0603  [0603]
C4  22u / 10V  CAPACITORC-0603  [0603]
C5  4.7u  CAPACITORC-0603  [0603]
C24  10u / 16V  CAPACITORC-0603  [0603]
IN  XLR_Female  3_PIN_PORT  [3_PIN_PORT]
R1  100k  RESISTOR  [R0603]
R2  100k  RESISTOR  [R0603]
R3  10k  RESISTOR  [R0603]
R4  10k  RESISTOR  [R0603]
R5  10k  RESISTOR  [R0603]
R6  100k  RESISTOR  [R0603]
R7  100k  RESISTOR  [R0603]
R8  100R  RESISTOR  [R0603]
R9  10k  RESISTOR  [R0603]
R10  10k  RESISTOR  [R0603]
R11  10k  RESISTOR  [R0603]
R12  100k  RESISTOR  [R0603]
R13  100k  RESISTOR  [R0603]
R14  100k  RESISTOR  [R0603]
R15  10k  RESISTOR  [R0603]
R16  10k  RESISTOR  [R0603]
R17  100R  RESISTOR  [R0603]
S/R  Switchable_jack  4_PIN_PORT  [4_PIN_PORT]
U2  TL074IDT  [SOIC127P600X175-14N]

### Nets
+9V: C24.2 U2.4(V+)
GAIN1_P2: R15.2 U2.13(IN-)
GAIN1_P3: R17.1 U2.14(OUT)
GND: C5.2 C24.1 IN.P$1(P1) R12.1 R13.1 S/R.P$1(P1) U2.11(V-)
N$1: C2.1 IN.P$3(P3) R2.1
N$2: C1.1 IN.P$2(P2) R1.1
N$3: R4.1 R9.2 U2.3(IN+)
N$4: R3.2 R5.1 U2.2(IN-)
N$5: C2.2 R3.1 R7.2
N$6: C1.2 R4.2 R6.2
N$7: R10.1 R11.2 U2.6(IN-)
N$8: R9.1 R11.1 U2.7(OUT)
N$10: C3.2 R12.2 S/R.P$2(P2)
N$11: C4.1 R13.2 S/R.P$3(P3) S/R.P$4(P4)
N$12: C4.2 R14.2 U2.12(IN+)
N$14: C5.1 R15.1
N$15: C3.1 R8.2
OUT: U2.8(OUT) U2.9(IN-)
SR-BYPASS: R5.2 R8.1 R10.2 U2.1(OUT)
SR-OUT: R17.2
SR-SELECT: R16.1
VDD: R6.1 R7.1 R14.1 U2.5(IN+)
VEE: R1.2 R2.2
VOL1_P2: U2.10(IN+)
VOL1_P3: R16.2

### Notes on the sheet
- VEE = Phantom power
- Should be A100k
- Should be A100k

### Library data of the parts
C1 C2 = lib:CAPACITOR: Capacitor; LINK: https://www.mouser.se/ProductDetail/TDK/C5750X7S2A226M280KB?qs=sGAEpiMZZMsh%252B1woXyUXj%252BH%2Fz7ysGLLiRJybAXc31rk%3D; MOUSERNO: 810-C5750X7S2A226280; MPN: C5750X7S2A226M280KB; SUPPLIER: Mouser
C3 C4 C24 = lib:CAPACITOR: Capacitor; LINK: https://www.mouser.se/ProductDetail/Murata-Electronics/GRM187R61A226ME15D?qs=sGAEpiMZZMsh%252B1woXyUXjxHEpf2Q6q57J1Ind0WCnj4%3D; MOUSERNR: 81-GRM187R61A226ME5D; MPN: GRM187R61A226ME15D; SUPPLIER: Mouser
C5 = lib:CAPACITOR: Capacitor
IN = lib:3_PIN_PORT
R1-R17 = lib:RESISTOR
S/R = lib:4_PIN_PORT
U2 = lib:TL074IDT: Low noise JFET quad operational amplifier; LINK: https://www.mouser.se/ProductDetail/STMicroelectronics/TL074IDT?qs=xiMLMHqF5JUaM%252BCWVyDQFA%3D%3D; MOUSERNR: 511-TL074IDT; MPN: TL074IDT; SUPPLIER: Mouser